# Altium schematic sheet RMII.SchDoc
size A4
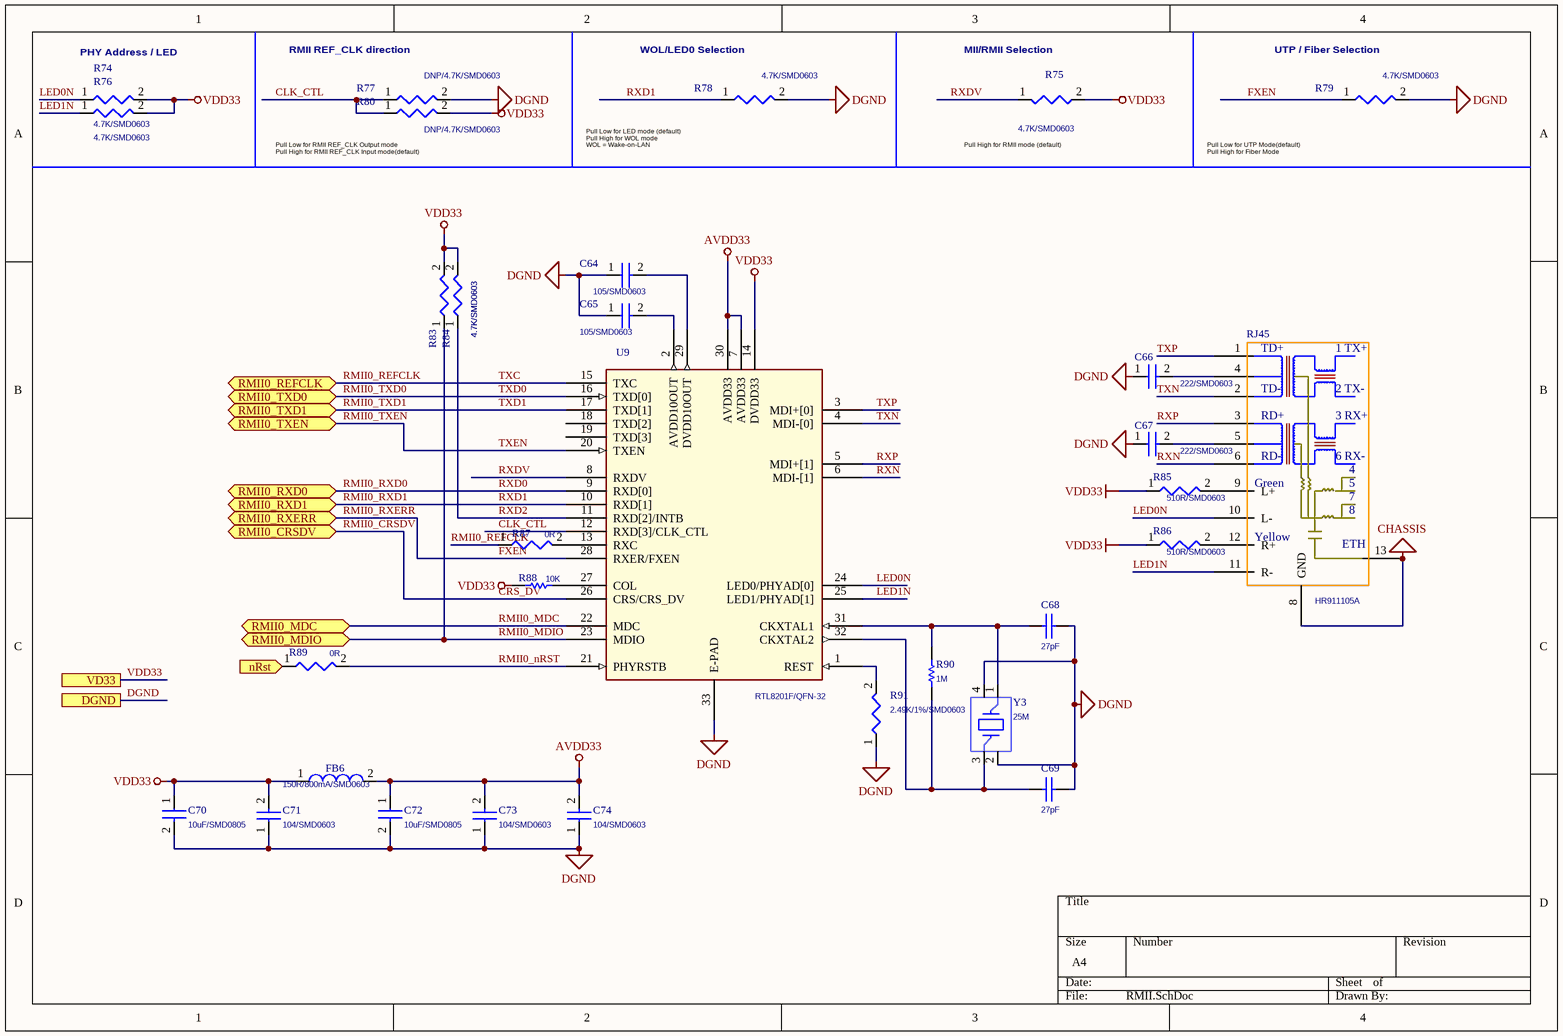
[diagram p0: RMII.SchDoc]

## Parts
C64  105/SMD0603  [0603C]
C65  105/SMD0603  [0603C]
C66  222/SMD0603  [0603C]
C67  222/SMD0603  [0603C]
C68  27pF  [0603C]
C69  27pF  [0603C]
C70  10uF/SMD0805  [C0805]
C71  104/SMD0603  [0603C]
C72  10uF/SMD0805  [C0805]
C73  104/SMD0603  [0603C]
C74  104/SMD0603  [0603C]
FB6  150R/800mA/SMD0603  [0603R]
R74  4.7K/SMD0603  [0603R]
R75  4.7K/SMD0603  [0603R]
R76  4.7K/SMD0603  [0603R]
R77  DNP/4.7K/SMD0603  [0603R]
R78  4.7K/SMD0603  [0603R]
R79  4.7K/SMD0603  [0603R]
R80  DNP/4.7K/SMD0603  [0603R]
R83  4.7K/SMD0603  [0603R]
R84  4.7K/SMD0603  [0603R]
R85  510R/SMD0603  [0603R]
R86  510R/SMD0603  [0603R]
R87  0R  [0603R]
R88  10K  [0603C]
R89  0R  [0603R]
R90  1M  [0603C]
R91  2.49K/1%/SMD0603  [0603R]
RJ45  HR911105A  [HR911105A]
U9  RTL8201F/QFN-32  [QFN32]
Y3  25M  [HCX-3SB3225]

## Ports
DGND, nRst (in), RMII0_CRSDV, RMII0_MDC, RMII0_MDIO, RMII0_REFCLK, RMII0_RXD0, RMII0_RXD1, RMII0_RXERR, RMII0_TXD0, RMII0_TXD1, RMII0_TXEN, VD33

## Nets
AVDD33: C72.1 C73.2 C74.2 FB6.2 U9.7(AVDD33) U9.30(AVDD33)
CHASSIS: RJ45.8(GND) RJ45.13
DGND: C64.1 C65.1 C66.1 C67.1 C68.2 C69.2 C70.2 C71.1 C72.2 C73.1 C74.1 R77.2 R78.2 R79.2 R91.1 U9.33(E-PAD) Y3.2 Y3.4 ; port DGND
VDD33: C70.1 C71.2 FB6.1 R74.2 R75.2 R76.2 R80.2 R83.2 R84.2 R85.1 R86.1 R88.2 U9.14(DVDD33) ; port VD33
CLK_CTL: R77.1 R80.1 U9.12(RXD[3]/CLK_CTL)
CRS_DV: U9.26(CRS/CRS_DV) ; port RMII0_CRSDV  [also labelled RMII0_CRSDV]
FXEN: R79.1 U9.28(RXER/FXEN) ; port RMII0_RXERR  [also labelled RMII0_RXERR]
LED0N: R74.1 RJ45.10(L-) U9.24(LED0/PHYAD[0])
LED1N: R76.1 RJ45.11(R-) U9.25(LED1/PHYAD[1])
nRst: R89.1 ; port nRst
RMII0_MDC: U9.22(MDC) ; port RMII0_MDC
RMII0_MDIO: R83.1 U9.23(MDIO) ; port RMII0_MDIO
RMII0_nRST: R89.2 U9.21(PHYRSTB)
RMII0_REFCLK: R87.1 U9.15(TXC) ; port RMII0_REFCLK  [also labelled TXC]
RMII0_RXD0: U9.9(RXD[0]) ; port RMII0_RXD0  [also labelled RXD0]
RMII0_RXD1: R78.1 U9.10(RXD[1]) ; port RMII0_RXD1  [also labelled RXD1]
RMII0_TXD0: U9.16(TXD[0]) ; port RMII0_TXD0  [also labelled TXD0]
RMII0_TXD1: U9.17(TXD[1]) ; port RMII0_TXD1  [also labelled TXD1]
RMII0_TXEN: U9.20(TXEN) ; port RMII0_TXEN  [also labelled TXEN]
RXD2: R84.1 U9.11(RXD[2]/INTB)
RXDV: R75.1 U9.8(RXDV)
RXN: RJ45.6 U9.6(MDI-[1])
RXP: RJ45.3 U9.5(MDI+[1])
TXN: RJ45.2 U9.4(MDI-[0])
TXP: RJ45.1 U9.3(MDI+[0])
NetC64_2: C64.2 U9.29(DVDD10OUT)
NetC65_2: C65.2 U9.2(AVDD10OUT)
NetC66_2: C66.2 RJ45.4
NetC67_2: C67.2 RJ45.5
NetC68_1: C68.1 R90.2 U9.31(CKXTAL1) Y3.1
NetC69_1: C69.1 R90.1 U9.32(CKXTAL2) Y3.3
NetR85_2: R85.2 RJ45.9(L+)
NetR86_2: R86.2 RJ45.12(R+)
NetR87_2: R87.2 U9.13(RXC)
NetR88_1: R88.1 U9.27(COL)
NetR91_2: R91.2 U9.1(REST)

Not connected (* = marked no-connect by the designer): U9 18(TXD[2]) 19(TXD[3])

## Notes on the sheet
- PHY Address / LED
- RMII REF_CLK direction
- (near R78) WOL/LED0 Selection
- (near R75) MII/RMII Selection
- (near R79) UTP / Fiber Selection
- Pull Low for RMII REF_CLK Output mode
  Pull High for RMII REF_CLK Input mode(default)
- (near R78) Pull Low for LED mode (default)
  Pull High for WOL mode
  WOL = Wake-on-LAN
- (near R75) Pull High for RMII mode (default)
- (near R79) Pull Low for UTP Mode(default)
  Pull High for Fiber Mode
- (in symbol HR911105A) TD+; 1 TX+; TD-; 2 TX-; RD+; 3 RX+; RD-; 6 RX-; Green; 7; Yellow; ETH

## Library data of the parts
C64-C67 C71 C73 C74 = C/SMD0603
C68 C69 = CAP: Capacitor
C70 C72 = C/SMD0805
FB6 = FB/SMD0603
R74-R80 R83-R87 R89 R91 = R/SMD0603
R88 R90 = Res1: Resistor; Value: 1K; Published: 8-Jun-2000; Revision: July-2002: Re-released for DXP Platform.; Publisher: Altium Limited
Y3 = 12Mhz